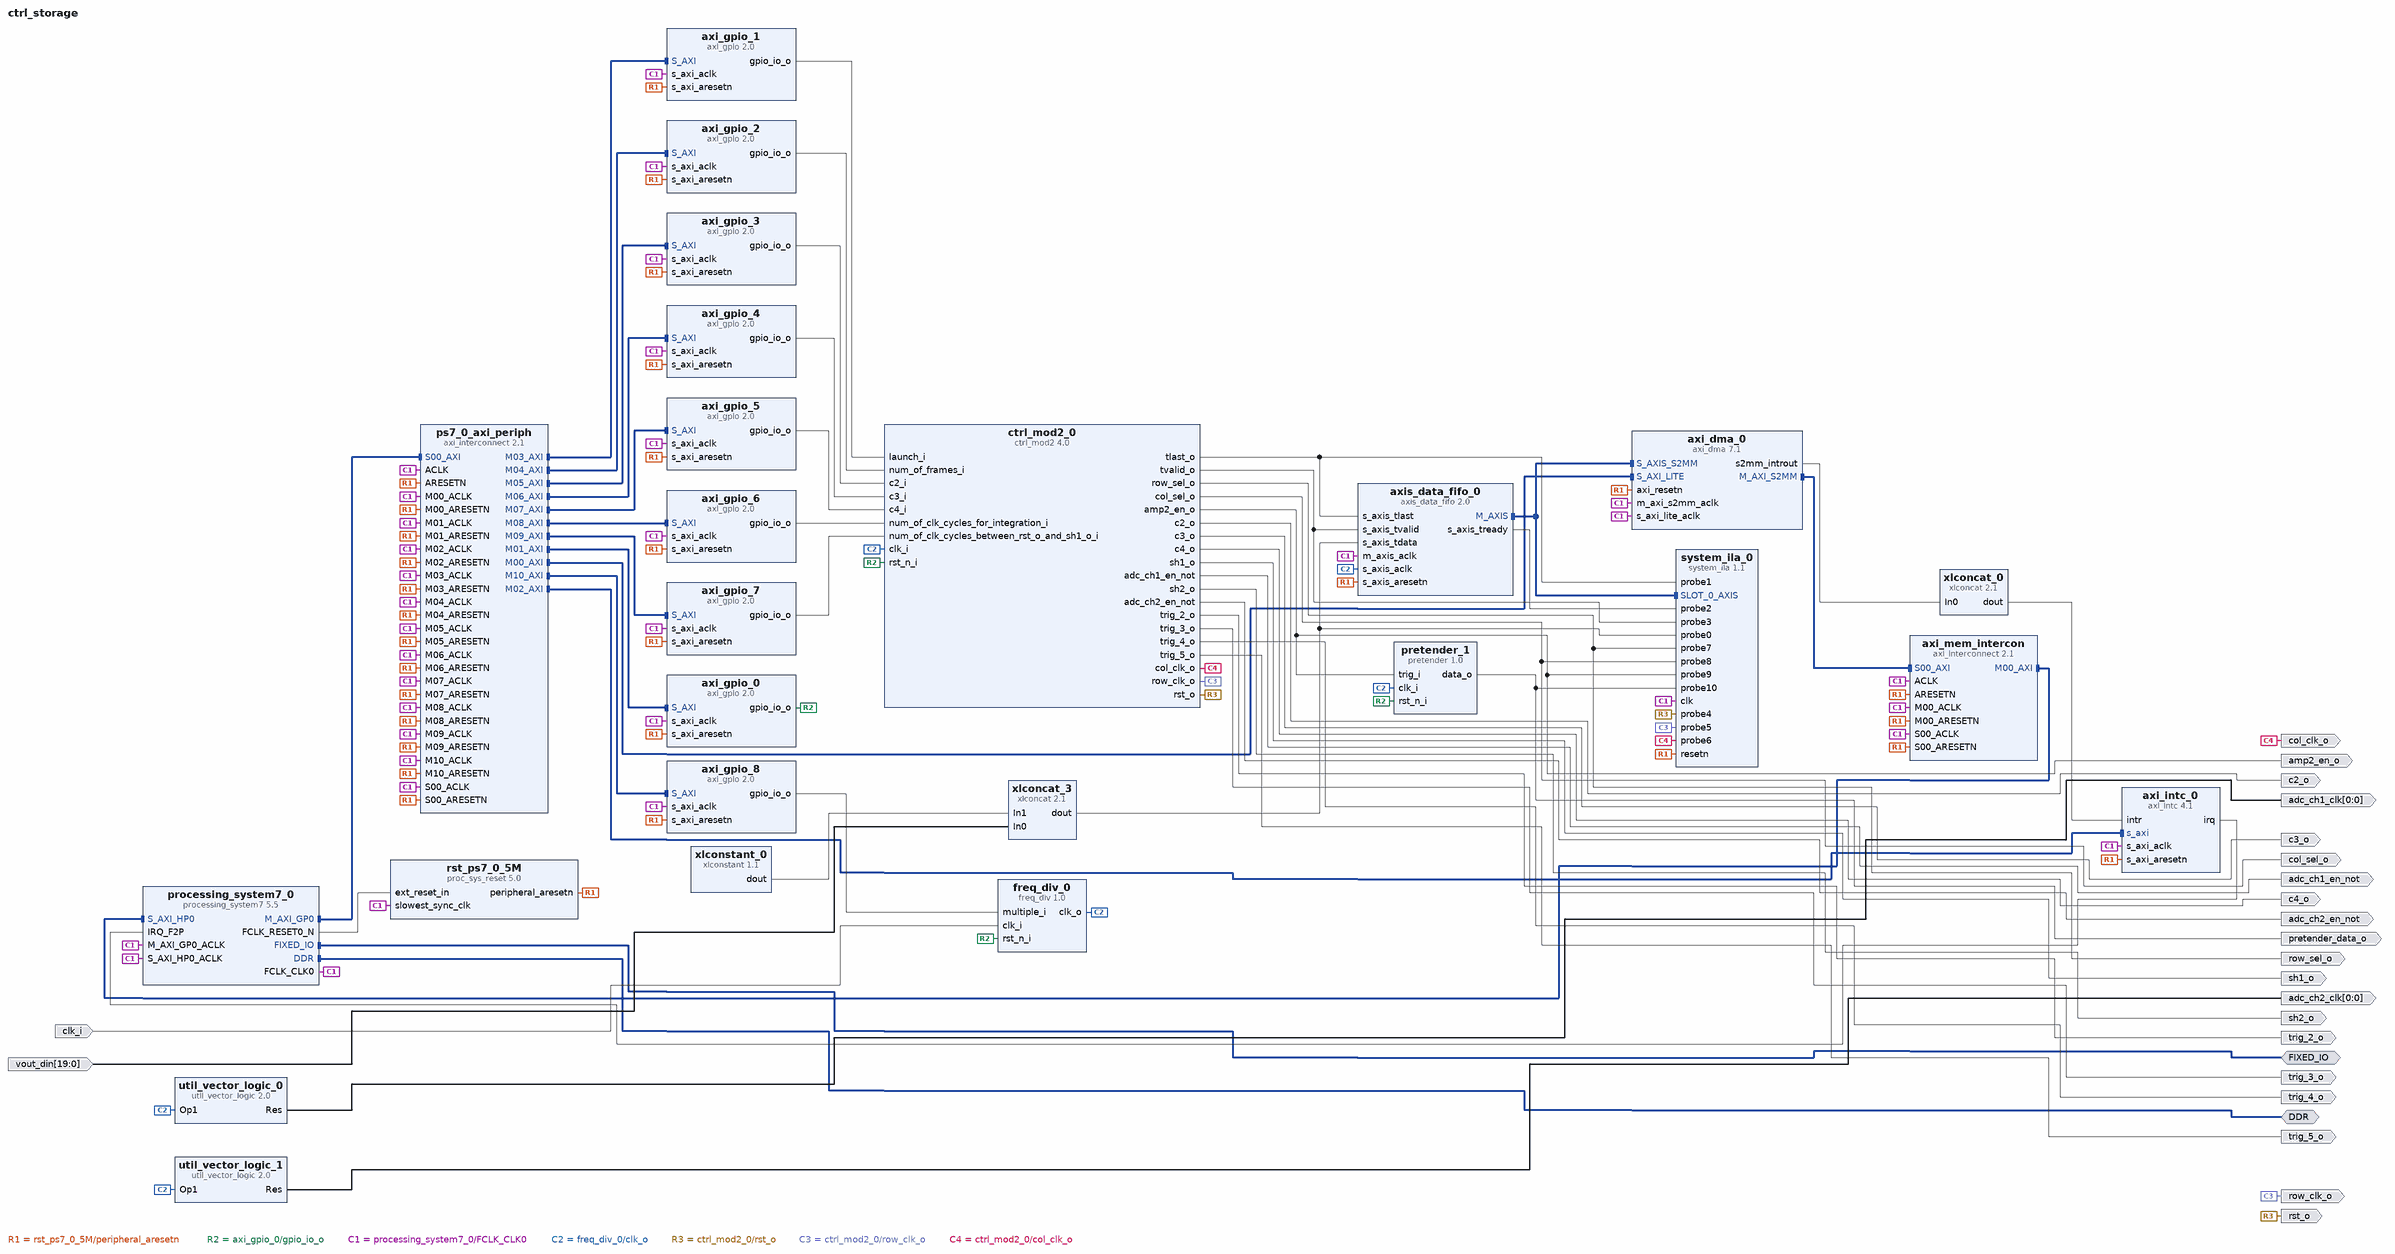
[diagram p0: block diagram of the top level]
# Vivado block design ctrl_storage, xc7z020clg400-2, Vivado 2019.2
create_bd_design ctrl_storage

create_bd_intf_port -mode Master -vlnv xilinx.com:interface:ddrx_rtl:1.0 DDR
create_bd_intf_port -mode Master -vlnv xilinx.com:display_processing_system7:fixedio_rtl:1.0 FIXED_IO
create_bd_port -dir I clk_i
create_bd_port -dir O row_sel_o
create_bd_port -dir O c3_o
create_bd_port -dir O c2_o
create_bd_port -dir O rst_o
create_bd_port -dir O col_clk_o
create_bd_port -dir O row_clk_o
create_bd_port -dir O sh1_o
create_bd_port -dir O c4_o
create_bd_port -dir O amp2_en_o
create_bd_port -dir O sh2_o
create_bd_port -dir O col_sel_o
create_bd_port -dir O trig_3_o
create_bd_port -dir O trig_2_o
create_bd_port -dir O trig_4_o
create_bd_port -dir O trig_5_o
create_bd_port -dir O -from 0 -to 0 adc_ch1_clk
create_bd_port -dir O -from 0 -to 0 adc_ch2_clk
create_bd_port -dir O adc_ch1_en_not
create_bd_port -dir O adc_ch2_en_not
create_bd_port -dir I -from 19 -to 0 vout_din
create_bd_port -dir O pretender_data_o

create_bd_cell -type ip -vlnv xilinx.com:ip:processing_system7:5.5 processing_system7_0
set_property -dict [list \
  CONFIG.PCW_FPGA0_PERIPHERAL_FREQMHZ 50 \
  CONFIG.PCW_IRQ_F2P_INTR 1 \
  CONFIG.PCW_UART0_PERIPHERAL_ENABLE 1 \
  CONFIG.PCW_UART0_UART0_IO {MIO 14 .. 15} \
  CONFIG.PCW_UART_PERIPHERAL_FREQMHZ 100 \
  CONFIG.PCW_UIPARAM_DDR_PARTNO {MT41J256M16 RE-125} \
  CONFIG.PCW_USE_FABRIC_INTERRUPT 1 \
  CONFIG.PCW_USE_S_AXI_HP0 1 \
] [get_bd_cells processing_system7_0]
# 42 more settings of processing_system7_0 are not shown: defaults, MIO pin electricals, DDR timing, and values the tool derives
create_bd_cell -type ip -vlnv xilinx.com:ip:axi_gpio:2.0 axi_gpio_0
set_property -dict [list \
  CONFIG.C_ALL_INPUTS 0 \
  CONFIG.C_ALL_OUTPUTS 1 \
  CONFIG.C_DOUT_DEFAULT 0xFFFFFFFF \
  CONFIG.C_GPIO_WIDTH 1 \
] [get_bd_cells axi_gpio_0]
create_bd_cell -type ip -vlnv xilinx.com:ip:axi_dma:7.1 axi_dma_0
set_property -dict [list \
  CONFIG.c_include_mm2s 0 \
  CONFIG.c_include_sg 0 \
  CONFIG.c_s2mm_burst_size 16 \
  CONFIG.c_s_axis_s2mm_tdata_width 32 \
] [get_bd_cells axi_dma_0]
create_bd_cell -type ip -vlnv xilinx.com:ip:axis_data_fifo:2.0 axis_data_fifo_0
set_property -dict [list \
  CONFIG.FIFO_DEPTH 16384 \
  CONFIG.HAS_TLAST 1 \
  CONFIG.IS_ACLK_ASYNC 1 \
  CONFIG.TDATA_NUM_BYTES 4 \
] [get_bd_cells axis_data_fifo_0]
create_bd_cell -type ip -vlnv xilinx.com:ip:xlconcat:2.1 xlconcat_0
set_property -dict {CONFIG.NUM_PORTS 1} [get_bd_cells xlconcat_0]
create_bd_cell -type ip -vlnv xilinx.com:ip:axi_intc:4.1 axi_intc_0
create_bd_cell -type ip -vlnv xilinx.com:ip:axi_interconnect:2.1 ps7_0_axi_periph
set_property -dict {CONFIG.NUM_MI 11} [get_bd_cells ps7_0_axi_periph]
create_bd_cell -type ip -vlnv xilinx.com:ip:axi_gpio:2.0 axi_gpio_1
set_property -dict {CONFIG.C_ALL_OUTPUTS 1 CONFIG.C_GPIO_WIDTH 1} [get_bd_cells axi_gpio_1]
create_bd_cell -type ip -vlnv xilinx.com:ip:axi_gpio:2.0 axi_gpio_2
set_property -dict {CONFIG.C_ALL_OUTPUTS 1 CONFIG.C_GPIO_WIDTH 24} [get_bd_cells axi_gpio_2]
create_bd_cell -type ip -vlnv xilinx.com:user:freq_div:1.0 freq_div_0
create_bd_cell -type ip -vlnv xilinx.com:ip:axi_gpio:2.0 axi_gpio_3
set_property -dict {CONFIG.C_ALL_OUTPUTS 1 CONFIG.C_GPIO_WIDTH 1} [get_bd_cells axi_gpio_3]
create_bd_cell -type ip -vlnv xilinx.com:ip:axi_gpio:2.0 axi_gpio_4
set_property -dict {CONFIG.C_ALL_OUTPUTS 1 CONFIG.C_GPIO_WIDTH 1} [get_bd_cells axi_gpio_4]
create_bd_cell -type ip -vlnv xilinx.com:ip:axi_gpio:2.0 axi_gpio_5
set_property -dict {CONFIG.C_ALL_OUTPUTS 1 CONFIG.C_GPIO_WIDTH 1} [get_bd_cells axi_gpio_5]
create_bd_cell -type ip -vlnv xilinx.com:ip:axi_gpio:2.0 axi_gpio_6
set_property -dict {CONFIG.C_ALL_OUTPUTS 1 CONFIG.C_DOUT_DEFAULT 0x0000000A CONFIG.C_GPIO_WIDTH 16} [get_bd_cells axi_gpio_6]
create_bd_cell -type ip -vlnv xilinx.com:ip:axi_gpio:2.0 axi_gpio_7
set_property -dict {CONFIG.C_ALL_OUTPUTS 1 CONFIG.C_DOUT_DEFAULT 0x00000002 CONFIG.C_GPIO_WIDTH 8} [get_bd_cells axi_gpio_7]
create_bd_cell -type ip -vlnv xilinx.com:ip:axi_gpio:2.0 axi_gpio_8
set_property -dict {CONFIG.C_ALL_OUTPUTS 1 CONFIG.C_DOUT_DEFAULT 0x00000002 CONFIG.C_GPIO_WIDTH 16} [get_bd_cells axi_gpio_8]
create_bd_cell -type ip -vlnv xilinx.com:ip:axi_interconnect:2.1 axi_mem_intercon
set_property -dict {CONFIG.NUM_MI 1} [get_bd_cells axi_mem_intercon]
create_bd_cell -type ip -vlnv xilinx.com:ip:proc_sys_reset:5.0 rst_ps7_0_5M
create_bd_cell -type ip -vlnv xilinx.com:ip:util_vector_logic:2.0 util_vector_logic_0
set_property -dict {CONFIG.C_OPERATION not CONFIG.C_SIZE 1} [get_bd_cells util_vector_logic_0]
create_bd_cell -type ip -vlnv xilinx.com:ip:util_vector_logic:2.0 util_vector_logic_1
set_property -dict {CONFIG.C_OPERATION not CONFIG.C_SIZE 1} [get_bd_cells util_vector_logic_1]
create_bd_cell -type ip -vlnv xilinx.com:ip:xlconstant:1.1 xlconstant_0
set_property -dict {CONFIG.CONST_VAL 0 CONFIG.CONST_WIDTH 12} [get_bd_cells xlconstant_0]
create_bd_cell -type ip -vlnv xilinx.com:ip:system_ila:1.1 system_ila_0
set_property -dict [list \
  CONFIG.C_DATA_DEPTH 16384 \
  CONFIG.C_MON_TYPE MIX \
  CONFIG.C_NUM_OF_PROBES 11 \
  CONFIG.C_SLOT_0_INTF_TYPE xilinx.com:interface:axis_rtl:1.0 \
] [get_bd_cells system_ila_0]
create_bd_cell -type ip -vlnv xilinx.com:ip:xlconcat:2.1 xlconcat_3
set_property -dict {CONFIG.IN0_WIDTH 20 CONFIG.IN1_WIDTH 12 CONFIG.IN2_WIDTH 12 CONFIG.NUM_PORTS 2} [get_bd_cells xlconcat_3]
create_bd_cell -type ip -vlnv xilinx.com:user:pretender:1.0 pretender_1
create_bd_cell -type ip -vlnv xilinx.com:user:ctrl_mod2:4.0 ctrl_mod2_0

# ---- connections ----

connect_bd_intf_net [get_bd_intf_ports FIXED_IO] [get_bd_intf_pins processing_system7_0/FIXED_IO]
connect_bd_intf_net [get_bd_intf_pins ps7_0_axi_periph/M00_AXI] [get_bd_intf_pins axi_dma_0/S_AXI_LITE]
connect_bd_intf_net [get_bd_intf_pins processing_system7_0/M_AXI_GP0] [get_bd_intf_pins ps7_0_axi_periph/S00_AXI]
connect_bd_intf_net [get_bd_intf_pins ps7_0_axi_periph/M10_AXI] [get_bd_intf_pins axi_gpio_8/S_AXI]
connect_bd_intf_net [get_bd_intf_pins ps7_0_axi_periph/M05_AXI] [get_bd_intf_pins axi_gpio_3/S_AXI]
connect_bd_intf_net [get_bd_intf_pins ps7_0_axi_periph/M02_AXI] [get_bd_intf_pins axi_intc_0/s_axi]
connect_bd_intf_net [get_bd_intf_pins ps7_0_axi_periph/M03_AXI] [get_bd_intf_pins axi_gpio_1/S_AXI]
connect_bd_intf_net [get_bd_intf_pins ps7_0_axi_periph/M06_AXI] [get_bd_intf_pins axi_gpio_4/S_AXI]
connect_bd_intf_net [get_bd_intf_pins ps7_0_axi_periph/M08_AXI] [get_bd_intf_pins axi_gpio_6/S_AXI]
connect_bd_intf_net [get_bd_intf_pins axi_mem_intercon/M00_AXI] [get_bd_intf_pins processing_system7_0/S_AXI_HP0]
connect_bd_intf_net [get_bd_intf_pins ps7_0_axi_periph/M01_AXI] [get_bd_intf_pins axi_gpio_0/S_AXI]
connect_bd_intf_net [get_bd_intf_pins ps7_0_axi_periph/M04_AXI] [get_bd_intf_pins axi_gpio_2/S_AXI]
connect_bd_intf_net [get_bd_intf_pins ps7_0_axi_periph/M09_AXI] [get_bd_intf_pins axi_gpio_7/S_AXI]
connect_bd_intf_net [get_bd_intf_pins axi_dma_0/M_AXI_S2MM] [get_bd_intf_pins axi_mem_intercon/S00_AXI]
connect_bd_intf_net [get_bd_intf_pins ps7_0_axi_periph/M07_AXI] [get_bd_intf_pins axi_gpio_5/S_AXI]
connect_bd_intf_net [get_bd_intf_ports DDR] [get_bd_intf_pins processing_system7_0/DDR]
connect_bd_intf_net -intf_net axis_data_fifo_0_M_AXIS [get_bd_intf_pins axis_data_fifo_0/M_AXIS] [get_bd_intf_pins axi_dma_0/S_AXIS_S2MM]
connect_bd_intf_net [get_bd_intf_pins axis_data_fifo_0/M_AXIS] [get_bd_intf_pins system_ila_0/SLOT_0_AXIS]
connect_bd_net [get_bd_pins rst_ps7_0_5M/peripheral_aresetn] \
  [get_bd_pins ps7_0_axi_periph/S00_ARESETN] [get_bd_pins axi_dma_0/axi_resetn] [get_bd_pins ps7_0_axi_periph/M00_ARESETN] \
  [get_bd_pins ps7_0_axi_periph/ARESETN] [get_bd_pins axi_gpio_0/s_axi_aresetn] [get_bd_pins ps7_0_axi_periph/M01_ARESETN] \
  [get_bd_pins axi_intc_0/s_axi_aresetn] [get_bd_pins ps7_0_axi_periph/M02_ARESETN] \
  [get_bd_pins axis_data_fifo_0/s_axis_aresetn] [get_bd_pins axi_gpio_1/s_axi_aresetn] \
  [get_bd_pins ps7_0_axi_periph/M03_ARESETN] [get_bd_pins axi_gpio_2/s_axi_aresetn] \
  [get_bd_pins ps7_0_axi_periph/M04_ARESETN] [get_bd_pins axi_gpio_3/s_axi_aresetn] \
  [get_bd_pins ps7_0_axi_periph/M05_ARESETN] [get_bd_pins axi_gpio_4/s_axi_aresetn] \
  [get_bd_pins ps7_0_axi_periph/M06_ARESETN] [get_bd_pins axi_gpio_5/s_axi_aresetn] \
  [get_bd_pins ps7_0_axi_periph/M07_ARESETN] [get_bd_pins axi_gpio_6/s_axi_aresetn] \
  [get_bd_pins ps7_0_axi_periph/M08_ARESETN] [get_bd_pins axi_gpio_7/s_axi_aresetn] \
  [get_bd_pins ps7_0_axi_periph/M09_ARESETN] [get_bd_pins axi_gpio_8/s_axi_aresetn] \
  [get_bd_pins ps7_0_axi_periph/M10_ARESETN] [get_bd_pins axi_mem_intercon/ARESETN] \
  [get_bd_pins axi_mem_intercon/M00_ARESETN] [get_bd_pins axi_mem_intercon/S00_ARESETN] [get_bd_pins system_ila_0/resetn]
connect_bd_net [get_bd_pins axi_dma_0/s2mm_introut] [get_bd_pins xlconcat_0/In0]
connect_bd_net [get_bd_pins xlconcat_0/dout] [get_bd_pins axi_intc_0/intr]
connect_bd_net [get_bd_pins axi_intc_0/irq] [get_bd_pins processing_system7_0/IRQ_F2P]
connect_bd_net [get_bd_pins axi_gpio_0/gpio_io_o] [get_bd_pins freq_div_0/rst_n_i] [get_bd_pins pretender_1/rst_n_i] [get_bd_pins ctrl_mod2_0/rst_n_i]
connect_bd_net [get_bd_pins processing_system7_0/FCLK_CLK0] \
  [get_bd_pins processing_system7_0/M_AXI_GP0_ACLK] [get_bd_pins ps7_0_axi_periph/S00_ACLK] \
  [get_bd_pins axi_dma_0/s_axi_lite_aclk] [get_bd_pins ps7_0_axi_periph/M00_ACLK] [get_bd_pins ps7_0_axi_periph/ACLK] \
  [get_bd_pins axi_gpio_0/s_axi_aclk] [get_bd_pins ps7_0_axi_periph/M01_ACLK] [get_bd_pins axi_intc_0/s_axi_aclk] \
  [get_bd_pins ps7_0_axi_periph/M02_ACLK] [get_bd_pins processing_system7_0/S_AXI_HP0_ACLK] \
  [get_bd_pins axi_dma_0/m_axi_s2mm_aclk] [get_bd_pins axi_gpio_1/s_axi_aclk] [get_bd_pins ps7_0_axi_periph/M03_ACLK] \
  [get_bd_pins axi_gpio_2/s_axi_aclk] [get_bd_pins ps7_0_axi_periph/M04_ACLK] [get_bd_pins axis_data_fifo_0/m_axis_aclk] \
  [get_bd_pins axi_gpio_3/s_axi_aclk] [get_bd_pins ps7_0_axi_periph/M05_ACLK] [get_bd_pins axi_gpio_4/s_axi_aclk] \
  [get_bd_pins ps7_0_axi_periph/M06_ACLK] [get_bd_pins axi_gpio_5/s_axi_aclk] [get_bd_pins ps7_0_axi_periph/M07_ACLK] \
  [get_bd_pins axi_gpio_6/s_axi_aclk] [get_bd_pins ps7_0_axi_periph/M08_ACLK] [get_bd_pins axi_gpio_7/s_axi_aclk] \
  [get_bd_pins ps7_0_axi_periph/M09_ACLK] [get_bd_pins axi_gpio_8/s_axi_aclk] [get_bd_pins ps7_0_axi_periph/M10_ACLK] \
  [get_bd_pins axi_mem_intercon/ACLK] [get_bd_pins axi_mem_intercon/M00_ACLK] [get_bd_pins axi_mem_intercon/S00_ACLK] \
  [get_bd_pins rst_ps7_0_5M/slowest_sync_clk] [get_bd_pins system_ila_0/clk]
connect_bd_net [get_bd_pins freq_div_0/clk_o] \
  [get_bd_pins axis_data_fifo_0/s_axis_aclk] [get_bd_pins util_vector_logic_0/Op1] [get_bd_pins util_vector_logic_1/Op1] \
  [get_bd_pins pretender_1/clk_i] [get_bd_pins ctrl_mod2_0/clk_i]
connect_bd_net -net clk_i_0_1 [get_bd_ports clk_i] [get_bd_pins freq_div_0/clk_i]
connect_bd_net [get_bd_pins axi_gpio_1/gpio_io_o] [get_bd_pins ctrl_mod2_0/launch_i]
connect_bd_net [get_bd_pins axi_gpio_2/gpio_io_o] [get_bd_pins ctrl_mod2_0/num_of_frames_i]
connect_bd_net [get_bd_pins axi_gpio_3/gpio_io_o] [get_bd_pins ctrl_mod2_0/c2_i]
connect_bd_net [get_bd_pins axi_gpio_4/gpio_io_o] [get_bd_pins ctrl_mod2_0/c3_i]
connect_bd_net [get_bd_pins axi_gpio_5/gpio_io_o] [get_bd_pins ctrl_mod2_0/c4_i]
connect_bd_net [get_bd_pins axi_gpio_6/gpio_io_o] [get_bd_pins ctrl_mod2_0/num_of_clk_cycles_for_integration_i]
connect_bd_net [get_bd_pins axi_gpio_7/gpio_io_o] [get_bd_pins ctrl_mod2_0/num_of_clk_cycles_between_rst_o_and_sh1_o_i]
connect_bd_net [get_bd_pins axi_gpio_8/gpio_io_o] [get_bd_pins freq_div_0/multiple_i]
connect_bd_net [get_bd_pins processing_system7_0/FCLK_RESET0_N] [get_bd_pins rst_ps7_0_5M/ext_reset_in]
connect_bd_net [get_bd_pins util_vector_logic_0/Res] [get_bd_ports adc_ch1_clk]
connect_bd_net [get_bd_pins util_vector_logic_1/Res] [get_bd_ports adc_ch2_clk]
connect_bd_net -net ctrl_mod2_1_rst_o [get_bd_pins ctrl_mod2_0/rst_o] [get_bd_ports rst_o] [get_bd_pins system_ila_0/probe4]
connect_bd_net -net ctrl_mod2_1_row_clk_o [get_bd_pins ctrl_mod2_0/row_clk_o] [get_bd_ports row_clk_o] [get_bd_pins system_ila_0/probe5]
connect_bd_net -net ctrl_mod2_1_col_clk_o [get_bd_pins ctrl_mod2_0/col_clk_o] [get_bd_ports col_clk_o] [get_bd_pins system_ila_0/probe6]
connect_bd_net -net ctrl_mod2_1_row_sel_o [get_bd_pins ctrl_mod2_0/row_sel_o] [get_bd_ports row_sel_o] [get_bd_pins system_ila_0/probe7]
connect_bd_net -net ctrl_mod2_1_col_sel_o [get_bd_pins ctrl_mod2_0/col_sel_o] [get_bd_ports col_sel_o] [get_bd_pins system_ila_0/probe8]
connect_bd_net -net ctrl_mod2_1_amp2_en_o [get_bd_pins ctrl_mod2_0/amp2_en_o] \
  [get_bd_ports amp2_en_o] [get_bd_pins system_ila_0/probe9] [get_bd_pins pretender_1/trig_i]
connect_bd_net -net ctrl_mod2_1_tlast_o [get_bd_pins ctrl_mod2_0/tlast_o] \
  [get_bd_pins axis_data_fifo_0/s_axis_tlast] [get_bd_pins system_ila_0/probe1]
connect_bd_net -net ctrl_mod2_1_tvalid_o [get_bd_pins ctrl_mod2_0/tvalid_o] \
  [get_bd_pins axis_data_fifo_0/s_axis_tvalid] [get_bd_pins system_ila_0/probe3]
connect_bd_net -net xlconcat_1_dout [get_bd_pins xlconcat_3/dout] [get_bd_pins axis_data_fifo_0/s_axis_tdata] [get_bd_pins system_ila_0/probe0]
connect_bd_net -net axis_data_fifo_0_s_axis_tready [get_bd_pins axis_data_fifo_0/s_axis_tready] [get_bd_pins system_ila_0/probe2]
connect_bd_net -net In0_0_1 [get_bd_ports vout_din] [get_bd_pins xlconcat_3/In0]
connect_bd_net [get_bd_pins xlconstant_0/dout] [get_bd_pins xlconcat_3/In1]
connect_bd_net -net pretender_0_data_o [get_bd_pins pretender_1/data_o] [get_bd_ports pretender_data_o] [get_bd_pins system_ila_0/probe10]
connect_bd_net [get_bd_pins ctrl_mod2_0/c2_o] [get_bd_ports c2_o]
connect_bd_net [get_bd_pins ctrl_mod2_0/c3_o] [get_bd_ports c3_o]
connect_bd_net [get_bd_pins ctrl_mod2_0/c4_o] [get_bd_ports c4_o]
connect_bd_net [get_bd_pins ctrl_mod2_0/sh1_o] [get_bd_ports sh1_o]
connect_bd_net [get_bd_pins ctrl_mod2_0/sh2_o] [get_bd_ports sh2_o]
connect_bd_net [get_bd_pins ctrl_mod2_0/trig_2_o] [get_bd_ports trig_2_o]
connect_bd_net [get_bd_pins ctrl_mod2_0/trig_3_o] [get_bd_ports trig_3_o]
connect_bd_net [get_bd_pins ctrl_mod2_0/trig_4_o] [get_bd_ports trig_4_o]
connect_bd_net [get_bd_pins ctrl_mod2_0/trig_5_o] [get_bd_ports trig_5_o]
connect_bd_net [get_bd_pins ctrl_mod2_0/adc_ch1_en_not] [get_bd_ports adc_ch1_en_not]
connect_bd_net [get_bd_pins ctrl_mod2_0/adc_ch2_en_not] [get_bd_ports adc_ch2_en_not]
set_property HDL_ATTRIBUTE.DEBUG true [get_bd_intf_nets axis_data_fifo_0_M_AXIS]
set_property HDL_ATTRIBUTE.MARK_DEBUG true [get_bd_intf_nets axis_data_fifo_0_M_AXIS]
set_property HDL_ATTRIBUTE.DEBUG true [get_bd_nets ctrl_mod2_1_rst_o]
set_property HDL_ATTRIBUTE.MARK_DEBUG true [get_bd_nets ctrl_mod2_1_rst_o]
set_property HDL_ATTRIBUTE.DEBUG true [get_bd_nets ctrl_mod2_1_row_clk_o]
set_property HDL_ATTRIBUTE.MARK_DEBUG true [get_bd_nets ctrl_mod2_1_row_clk_o]
set_property HDL_ATTRIBUTE.DEBUG true [get_bd_nets ctrl_mod2_1_col_clk_o]
set_property HDL_ATTRIBUTE.MARK_DEBUG true [get_bd_nets ctrl_mod2_1_col_clk_o]
set_property HDL_ATTRIBUTE.DEBUG true [get_bd_nets ctrl_mod2_1_row_sel_o]
set_property HDL_ATTRIBUTE.MARK_DEBUG true [get_bd_nets ctrl_mod2_1_row_sel_o]
set_property HDL_ATTRIBUTE.DEBUG true [get_bd_nets ctrl_mod2_1_col_sel_o]
set_property HDL_ATTRIBUTE.MARK_DEBUG true [get_bd_nets ctrl_mod2_1_col_sel_o]
set_property HDL_ATTRIBUTE.DEBUG true [get_bd_nets ctrl_mod2_1_amp2_en_o]
set_property HDL_ATTRIBUTE.MARK_DEBUG true [get_bd_nets ctrl_mod2_1_amp2_en_o]
set_property HDL_ATTRIBUTE.DEBUG true [get_bd_nets ctrl_mod2_1_tlast_o]
set_property HDL_ATTRIBUTE.MARK_DEBUG true [get_bd_nets ctrl_mod2_1_tlast_o]
set_property HDL_ATTRIBUTE.DEBUG true [get_bd_nets ctrl_mod2_1_tvalid_o]
set_property HDL_ATTRIBUTE.MARK_DEBUG true [get_bd_nets ctrl_mod2_1_tvalid_o]
set_property HDL_ATTRIBUTE.DEBUG true [get_bd_nets xlconcat_1_dout]
set_property HDL_ATTRIBUTE.MARK_DEBUG true [get_bd_nets xlconcat_1_dout]
set_property HDL_ATTRIBUTE.DEBUG true [get_bd_nets axis_data_fifo_0_s_axis_tready]
set_property HDL_ATTRIBUTE.MARK_DEBUG true [get_bd_nets axis_data_fifo_0_s_axis_tready]
set_property HDL_ATTRIBUTE.DEBUG true [get_bd_nets pretender_0_data_o]
set_property HDL_ATTRIBUTE.MARK_DEBUG true [get_bd_nets pretender_0_data_o]

# ---- address map ----
assign_bd_address -offset 0x00000000 -range 1G -target_address_space [get_bd_addr_spaces axi_dma_0/Data_S2MM] [get_bd_addr_segs processing_system7_0/S_AXI_HP0/HP0_DDR_LOWOCM]
assign_bd_address -offset 0x40400000 -range 64K -target_address_space [get_bd_addr_spaces processing_system7_0/Data] [get_bd_addr_segs axi_dma_0/S_AXI_LITE/Reg]
assign_bd_address -offset 0x41200000 -range 64K -target_address_space [get_bd_addr_spaces processing_system7_0/Data] [get_bd_addr_segs axi_gpio_0/S_AXI/Reg]
assign_bd_address -offset 0x41210000 -range 64K -target_address_space [get_bd_addr_spaces processing_system7_0/Data] [get_bd_addr_segs axi_gpio_1/S_AXI/Reg]
assign_bd_address -offset 0x41220000 -range 64K -target_address_space [get_bd_addr_spaces processing_system7_0/Data] [get_bd_addr_segs axi_gpio_2/S_AXI/Reg]
assign_bd_address -offset 0x41230000 -range 64K -target_address_space [get_bd_addr_spaces processing_system7_0/Data] [get_bd_addr_segs axi_gpio_3/S_AXI/Reg]
assign_bd_address -offset 0x41240000 -range 64K -target_address_space [get_bd_addr_spaces processing_system7_0/Data] [get_bd_addr_segs axi_gpio_4/S_AXI/Reg]
assign_bd_address -offset 0x41250000 -range 64K -target_address_space [get_bd_addr_spaces processing_system7_0/Data] [get_bd_addr_segs axi_gpio_5/S_AXI/Reg]
assign_bd_address -offset 0x41260000 -range 64K -target_address_space [get_bd_addr_spaces processing_system7_0/Data] [get_bd_addr_segs axi_gpio_6/S_AXI/Reg]
assign_bd_address -offset 0x41270000 -range 64K -target_address_space [get_bd_addr_spaces processing_system7_0/Data] [get_bd_addr_segs axi_gpio_7/S_AXI/Reg]
assign_bd_address -offset 0x41280000 -range 64K -target_address_space [get_bd_addr_spaces processing_system7_0/Data] [get_bd_addr_segs axi_gpio_8/S_AXI/Reg]
assign_bd_address -offset 0x41800000 -range 64K -target_address_space [get_bd_addr_spaces processing_system7_0/Data] [get_bd_addr_segs axi_intc_0/S_AXI/Reg]

validate_bd_design
save_bd_design
